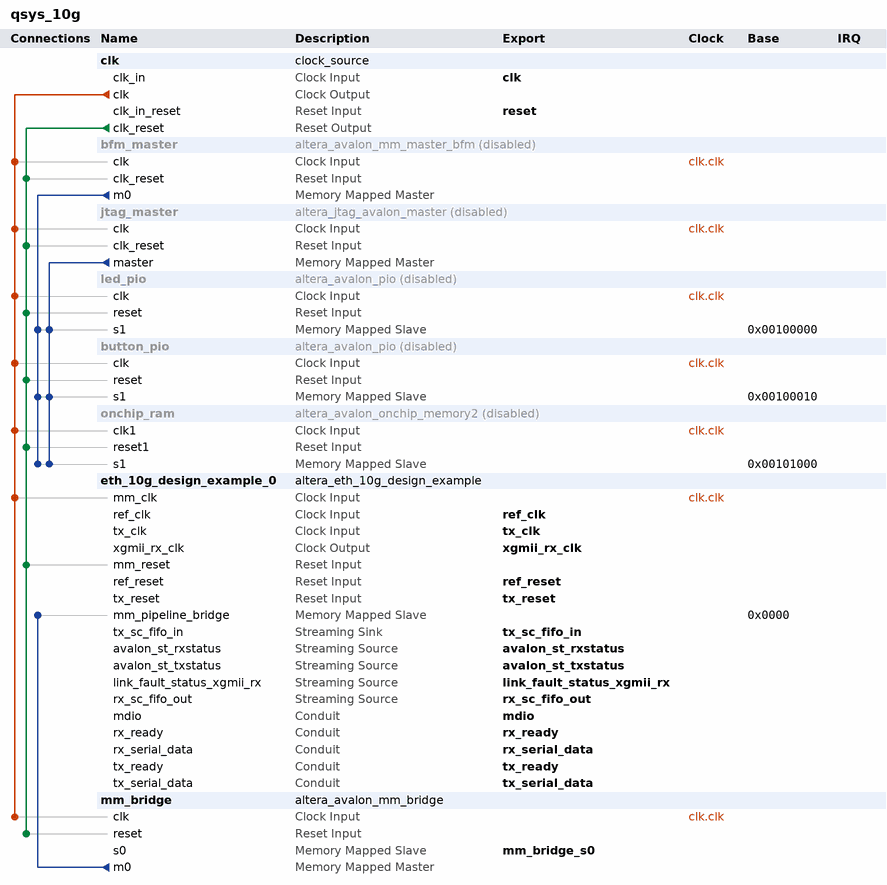
[diagram p0: system contents]
# Platform Designer (Qsys) system qsys_10g, Arria V 5ASTFD5K3F40I3ES
# Parameters at their usual value, and those the tool derives, are not listed.
package require -exact qsys 14.0
create_system qsys_10g
set_project_property DEVICE_FAMILY {Arria V}
set_project_property DEVICE 5ASTFD5K3F40I3ES

add_instance clk clock_source 14.0
set_instance_parameter_value clk clockFrequency 50000000
set_instance_parameter_value clk clockFrequencyKnown false

add_instance bfm_master altera_avalon_mm_master_bfm 14.0
set_instance_property bfm_master ENABLED false
set_instance_parameter_value bfm_master AV_ADDRESS_W 32
set_instance_parameter_value bfm_master AV_NUMSYMBOLS 4
set_instance_parameter_value bfm_master AV_BURSTCOUNT_W 3
set_instance_parameter_value bfm_master AV_READRESPONSE_W 8
set_instance_parameter_value bfm_master AV_WRITERESPONSE_W 8
set_instance_parameter_value bfm_master USE_READ 1
set_instance_parameter_value bfm_master USE_BYTE_ENABLE 1
set_instance_parameter_value bfm_master USE_BURSTCOUNT 0
set_instance_parameter_value bfm_master USE_READ_DATA 1
set_instance_parameter_value bfm_master USE_READ_DATA_VALID 1
set_instance_parameter_value bfm_master USE_WAIT_REQUEST 1
set_instance_parameter_value bfm_master AV_CONSTANT_BURST_BEHAVIOR 1
set_instance_parameter_value bfm_master AV_BURST_LINEWRAP 1
set_instance_parameter_value bfm_master AV_BURST_BNDR_ONLY 1
set_instance_parameter_value bfm_master AV_ALWAYS_BURST_MAX_BURST 0
set_instance_parameter_value bfm_master AV_MAX_PENDING_WRITES 0
set_instance_parameter_value bfm_master AV_FIX_READ_LATENCY 1
set_instance_parameter_value bfm_master AV_READ_WAIT_TIME 1
set_instance_parameter_value bfm_master ADDRESS_UNITS SYMBOLS
set_instance_parameter_value bfm_master VHDL_ID 0

add_instance jtag_master altera_jtag_avalon_master 14.0
set_instance_property jtag_master ENABLED false

add_instance led_pio altera_avalon_pio 14.0
set_instance_property led_pio ENABLED false
set_instance_parameter_value led_pio direction Output
set_instance_parameter_value led_pio width 4

add_instance button_pio altera_avalon_pio 14.0
set_instance_property button_pio ENABLED false
set_instance_parameter_value button_pio direction Input
set_instance_parameter_value button_pio width 4

add_instance onchip_ram altera_avalon_onchip_memory2 14.0
set_instance_property onchip_ram ENABLED false
set_instance_parameter_value onchip_ram dataWidth 32
set_instance_parameter_value onchip_ram dualPort false
set_instance_parameter_value onchip_ram initMemContent false
set_instance_parameter_value onchip_ram initializationFileName onchip_mem.hex
set_instance_parameter_value onchip_ram memorySize 4096

add_instance eth_10g_design_example_0 altera_eth_10g_design_example 14.0
set_instance_parameter_value eth_10g_design_example_0 DEVICE_FAMILY_TOP {Arria V}
set_instance_parameter_value eth_10g_design_example_0 ENABLE_MAC_LOOPBACK {10Gbps Ethernet MAC with LoopBack Enabled}
set_instance_parameter_value eth_10g_design_example_0 CHOOSE_MDIO_2_WIRE_SERIAL_INT 0
set_instance_parameter_value eth_10g_design_example_0 PHY_IP 1
set_instance_parameter_value eth_10g_design_example_0 CHOOSE_FIFO 0
set_instance_parameter_value eth_10g_design_example_0 ENABLE_TIMESTAMPING 0
set_instance_parameter_value eth_10g_design_example_0 ENABLE_PTP_1STEP 0
set_instance_parameter_value eth_10g_design_example_0 TSTAMP_FP_WIDTH 4
set_instance_parameter_value eth_10g_design_example_0 PREAMBLE_PASSTHROUGH 0
set_instance_parameter_value eth_10g_design_example_0 ENABLE_PFC 0
set_instance_parameter_value eth_10g_design_example_0 PFC_PRIORITY_NUM 8
set_instance_parameter_value eth_10g_design_example_0 DATAPATH_OPTION 3
set_instance_parameter_value eth_10g_design_example_0 ENABLE_SUPP_ADDR 1
set_instance_parameter_value eth_10g_design_example_0 INSTANTIATE_TX_CRC 1
set_instance_parameter_value eth_10g_design_example_0 INSTANTIATE_STATISTICS 1
set_instance_parameter_value eth_10g_design_example_0 REGISTER_BASED_STATISTICS 0
set_instance_parameter_value eth_10g_design_example_0 ENABLE_1G10G_MAC 0
set_instance_parameter_value eth_10g_design_example_0 ENABLE_UNIDIRECTIONAL 0
set_instance_parameter_value eth_10g_design_example_0 MDIO_MDC_DIVISOR 64
set_instance_parameter_value eth_10g_design_example_0 SYNC_TX_FIFO_SYMBOLS_PER_BEAT 8
set_instance_parameter_value eth_10g_design_example_0 SYNC_TX_FIFO_BITS_PER_SYMBOL 8
set_instance_parameter_value eth_10g_design_example_0 SYNC_TX_FIFO_DEPTH 512
set_instance_parameter_value eth_10g_design_example_0 SYNC_TX_FIFO_ERROR_WIDTH 1
set_instance_parameter_value eth_10g_design_example_0 SYNC_TX_USE_PACKETS 1
set_instance_parameter_value eth_10g_design_example_0 SYNC_TX_USE_FILL 1
set_instance_parameter_value eth_10g_design_example_0 SYNC_TX_USE_STORE_AND_FORWARD 1
set_instance_parameter_value eth_10g_design_example_0 SYNC_TX_USE_ALMOST_FULL 0
set_instance_parameter_value eth_10g_design_example_0 SYNC_TX_USE_ALMOST_EMPTY 0
set_instance_parameter_value eth_10g_design_example_0 SYNC_RX_FIFO_SYMBOLS_PER_BEAT 8
set_instance_parameter_value eth_10g_design_example_0 SYNC_RX_FIFO_BITS_PER_SYMBOL 8
set_instance_parameter_value eth_10g_design_example_0 SYNC_RX_FIFO_DEPTH 512
set_instance_parameter_value eth_10g_design_example_0 SYNC_RX_FIFO_ERROR_WIDTH 6
set_instance_parameter_value eth_10g_design_example_0 SYNC_RX_USE_PACKETS 1
set_instance_parameter_value eth_10g_design_example_0 SYNC_RX_USE_FILL 1
set_instance_parameter_value eth_10g_design_example_0 SYNC_RX_USE_STORE_AND_FORWARD 1
set_instance_parameter_value eth_10g_design_example_0 SYNC_RX_USE_ALMOST_FULL 1
set_instance_parameter_value eth_10g_design_example_0 SYNC_RX_USE_ALMOST_EMPTY 1
set_instance_parameter_value eth_10g_design_example_0 ASYNC_TX_FIFO_SYMBOLS_PER_BEAT 8
set_instance_parameter_value eth_10g_design_example_0 ASYNC_TX_FIFO_BITS_PER_SYMBOL 8
set_instance_parameter_value eth_10g_design_example_0 ASYNC_TX_FIFO_DEPTH 16
set_instance_parameter_value eth_10g_design_example_0 ASYNC_TX_FIFO_ERROR_WIDTH 1
set_instance_parameter_value eth_10g_design_example_0 ASYNC_TX_USE_PKT 1
set_instance_parameter_value eth_10g_design_example_0 ASYNC_TX_USE_SINK_FILL 0
set_instance_parameter_value eth_10g_design_example_0 ASYNC_TX_USE_SRC_FILL 0
set_instance_parameter_value eth_10g_design_example_0 ASYNC_RX_FIFO_SYMBOLS_PER_BEAT 8
set_instance_parameter_value eth_10g_design_example_0 ASYNC_RX_FIFO_BITS_PER_SYMBOL 8
set_instance_parameter_value eth_10g_design_example_0 ASYNC_RX_FIFO_DEPTH 16
set_instance_parameter_value eth_10g_design_example_0 ASYNC_RX_FIFO_ERROR_WIDTH 6
set_instance_parameter_value eth_10g_design_example_0 ASYNC_RX_USE_PKT 1
set_instance_parameter_value eth_10g_design_example_0 ASYNC_RX_USE_SINK_FILL 0
set_instance_parameter_value eth_10g_design_example_0 ASYNC_RX_USE_SRC_FILL 0
set_instance_parameter_value eth_10g_design_example_0 BASER_INTERFACE 0
set_instance_parameter_value eth_10g_design_example_0 BASER_PLL_TYPE CMU
set_instance_parameter_value eth_10g_design_example_0 BASER_STARTING_CHANNEL_NUMBER 0
set_instance_parameter_value eth_10g_design_example_0 BASER_REF_CLK_FREQ {322.265625 MHz}
set_instance_parameter_value eth_10g_design_example_0 BASER_TRANSMITTER_TERMINATION OCT_100_OHMS
set_instance_parameter_value eth_10g_design_example_0 BASER_PRE_EMPHASIS_PRE_TAP 0
set_instance_parameter_value eth_10g_design_example_0 BASER_PRE_EMPHASIS_PRE_TAP_POLARITY 0
set_instance_parameter_value eth_10g_design_example_0 BASER_PRE_EMPHASIS_FIRST_POST_TAP 15
set_instance_parameter_value eth_10g_design_example_0 BASER_PRE_EMPHASIS_SECOND_POST_TAP 0
set_instance_parameter_value eth_10g_design_example_0 BASER_PRE_EMPHASIS_SECOND_POST_TAP_POLARITY 0
set_instance_parameter_value eth_10g_design_example_0 BASER_TRANSMITTER_VOD 7
set_instance_parameter_value eth_10g_design_example_0 BASER_RECEIVER_TERMINATION OCT_100_OHMS
set_instance_parameter_value eth_10g_design_example_0 BASER_RECEIVER_DC_GAIN 0
set_instance_parameter_value eth_10g_design_example_0 BASER_RECEIVER_STATIC_EQUALIZER 0
set_instance_parameter_value eth_10g_design_example_0 BASER_EXT_PMA_CONTROL_CONF 0
set_instance_parameter_value eth_10g_design_example_0 BASER_ENA_ADD_CONTROL_STAT 0
set_instance_parameter_value eth_10g_design_example_0 BASER_RECOVERED_CLK_OUT 0
set_instance_parameter_value eth_10g_design_example_0 XAUI_STARTING_CHANNEL_NUMBER 0
set_instance_parameter_value eth_10g_design_example_0 starting_channel_number 0
set_instance_parameter_value eth_10g_design_example_0 interface_type {Soft XAUI}
set_instance_parameter_value eth_10g_design_example_0 soft_xaui_cfg {Only Soft XAUI is supported for this device.}
set_instance_parameter_value eth_10g_design_example_0 hard_xaui_cfg {Only Hard XAUI is supported for this device.}
set_instance_parameter_value eth_10g_design_example_0 gui_pll_type CMU
set_instance_parameter_value eth_10g_design_example_0 en_synce_support 0
set_instance_parameter_value eth_10g_design_example_0 use_control_and_status_ports 0
set_instance_parameter_value eth_10g_design_example_0 external_pma_ctrl_reconf 0
set_instance_parameter_value eth_10g_design_example_0 dyn_reconf 0
set_instance_parameter_value eth_10g_design_example_0 recovered_clk_out 0
set_instance_parameter_value eth_10g_design_example_0 number_of_interfaces 1
set_instance_parameter_value eth_10g_design_example_0 use_rx_rate_match 0
set_instance_parameter_value eth_10g_design_example_0 tx_termination OCT_100_OHMS
set_instance_parameter_value eth_10g_design_example_0 tx_vod_selection 4
set_instance_parameter_value eth_10g_design_example_0 tx_preemp_pretap 0
set_instance_parameter_value eth_10g_design_example_0 tx_preemp_pretap_inv false
set_instance_parameter_value eth_10g_design_example_0 tx_preemp_tap_1 0
set_instance_parameter_value eth_10g_design_example_0 tx_preemp_tap_2 0
set_instance_parameter_value eth_10g_design_example_0 tx_preemp_tap_2_inv false
set_instance_parameter_value eth_10g_design_example_0 rx_common_mode 0.82v
set_instance_parameter_value eth_10g_design_example_0 rx_termination OCT_100_OHMS
set_instance_parameter_value eth_10g_design_example_0 rx_eq_dc_gain 0
set_instance_parameter_value eth_10g_design_example_0 rx_eq_ctrl 0
set_instance_parameter_value eth_10g_design_example_0 pll_external_enable 0

add_instance mm_bridge altera_avalon_mm_bridge 14.0
set_instance_parameter_value mm_bridge DATA_WIDTH 32
set_instance_parameter_value mm_bridge ADDRESS_WIDTH 24
set_instance_parameter_value mm_bridge USE_AUTO_ADDRESS_WIDTH 0
set_instance_parameter_value mm_bridge ADDRESS_UNITS SYMBOLS
set_instance_parameter_value mm_bridge MAX_BURST_SIZE 8
set_instance_parameter_value mm_bridge MAX_PENDING_RESPONSES 1
set_instance_parameter_value mm_bridge PIPELINE_COMMAND 0
set_instance_parameter_value mm_bridge PIPELINE_RESPONSE 0

# connections
add_connection clk.clk bfm_master.clk clock
add_connection clk.clk button_pio.clk clock
add_connection clk.clk eth_10g_design_example_0.mm_clk clock
add_connection clk.clk jtag_master.clk clock
add_connection clk.clk led_pio.clk clock
add_connection clk.clk mm_bridge.clk clock
add_connection clk.clk onchip_ram.clk1 clock
add_connection clk.clk_reset bfm_master.clk_reset reset
add_connection clk.clk_reset button_pio.reset reset
add_connection clk.clk_reset eth_10g_design_example_0.mm_reset reset
add_connection clk.clk_reset jtag_master.clk_reset reset
add_connection clk.clk_reset led_pio.reset reset
add_connection clk.clk_reset mm_bridge.reset reset
add_connection clk.clk_reset onchip_ram.reset1 reset
add_connection bfm_master.m0 button_pio.s1 avalon
set_connection_parameter_value bfm_master.m0/button_pio.s1 baseAddress 0x00100010
add_connection bfm_master.m0 led_pio.s1 avalon
set_connection_parameter_value bfm_master.m0/led_pio.s1 baseAddress 0x00100000
add_connection bfm_master.m0 onchip_ram.s1 avalon
set_connection_parameter_value bfm_master.m0/onchip_ram.s1 baseAddress 0x00101000
add_connection jtag_master.master button_pio.s1 avalon
set_connection_parameter_value jtag_master.master/button_pio.s1 baseAddress 0x00100010
add_connection jtag_master.master led_pio.s1 avalon
set_connection_parameter_value jtag_master.master/led_pio.s1 baseAddress 0x00100000
add_connection jtag_master.master onchip_ram.s1 avalon
set_connection_parameter_value jtag_master.master/onchip_ram.s1 baseAddress 0x00101000
add_connection mm_bridge.m0 eth_10g_design_example_0.mm_pipeline_bridge avalon
set_connection_parameter_value mm_bridge.m0/eth_10g_design_example_0.mm_pipeline_bridge baseAddress 0x0000

# exported interfaces
add_interface clk clock sink
set_interface_property clk EXPORT_OF clk.clk_in
add_interface reset reset sink
set_interface_property reset EXPORT_OF clk.clk_in_reset
add_interface tx_clk clock sink
set_interface_property tx_clk EXPORT_OF eth_10g_design_example_0.tx_clk
add_interface tx_reset reset sink
set_interface_property tx_reset EXPORT_OF eth_10g_design_example_0.tx_reset
add_interface ref_clk clock sink
set_interface_property ref_clk EXPORT_OF eth_10g_design_example_0.ref_clk
add_interface ref_reset reset sink
set_interface_property ref_reset EXPORT_OF eth_10g_design_example_0.ref_reset
add_interface avalon_st_rxstatus avalon_streaming source
set_interface_property avalon_st_rxstatus EXPORT_OF eth_10g_design_example_0.avalon_st_rxstatus
add_interface link_fault_status_xgmii_rx avalon_streaming source
set_interface_property link_fault_status_xgmii_rx EXPORT_OF eth_10g_design_example_0.link_fault_status_xgmii_rx
add_interface rx_serial_data conduit end
set_interface_property rx_serial_data EXPORT_OF eth_10g_design_example_0.rx_serial_data
add_interface tx_serial_data conduit end
set_interface_property tx_serial_data EXPORT_OF eth_10g_design_example_0.tx_serial_data
add_interface rx_ready conduit end
set_interface_property rx_ready EXPORT_OF eth_10g_design_example_0.rx_ready
add_interface tx_ready conduit end
set_interface_property tx_ready EXPORT_OF eth_10g_design_example_0.tx_ready
add_interface tx_sc_fifo_in avalon_streaming sink
set_interface_property tx_sc_fifo_in EXPORT_OF eth_10g_design_example_0.tx_sc_fifo_in
add_interface rx_sc_fifo_out avalon_streaming source
set_interface_property rx_sc_fifo_out EXPORT_OF eth_10g_design_example_0.rx_sc_fifo_out
add_interface mdio conduit end
set_interface_property mdio EXPORT_OF eth_10g_design_example_0.mdio
add_interface avalon_st_txstatus avalon_streaming source
set_interface_property avalon_st_txstatus EXPORT_OF eth_10g_design_example_0.avalon_st_txstatus
add_interface xgmii_rx_clk clock source
set_interface_property xgmii_rx_clk EXPORT_OF eth_10g_design_example_0.xgmii_rx_clk
add_interface mm_bridge_s0 avalon slave
set_interface_property mm_bridge_s0 EXPORT_OF mm_bridge.s0

set_interconnect_requirement {$system} qsys_mm.clockCrossingAdapter HANDSHAKE
set_interconnect_requirement {$system} qsys_mm.maxAdditionalLatency 1
set_interconnect_requirement {$system} qsys_mm.insertDefaultSlave FALSE

save_system qsys_10g.qsys
